# Altium schematic sheet I2C_AccGyro.SchDoc
size A
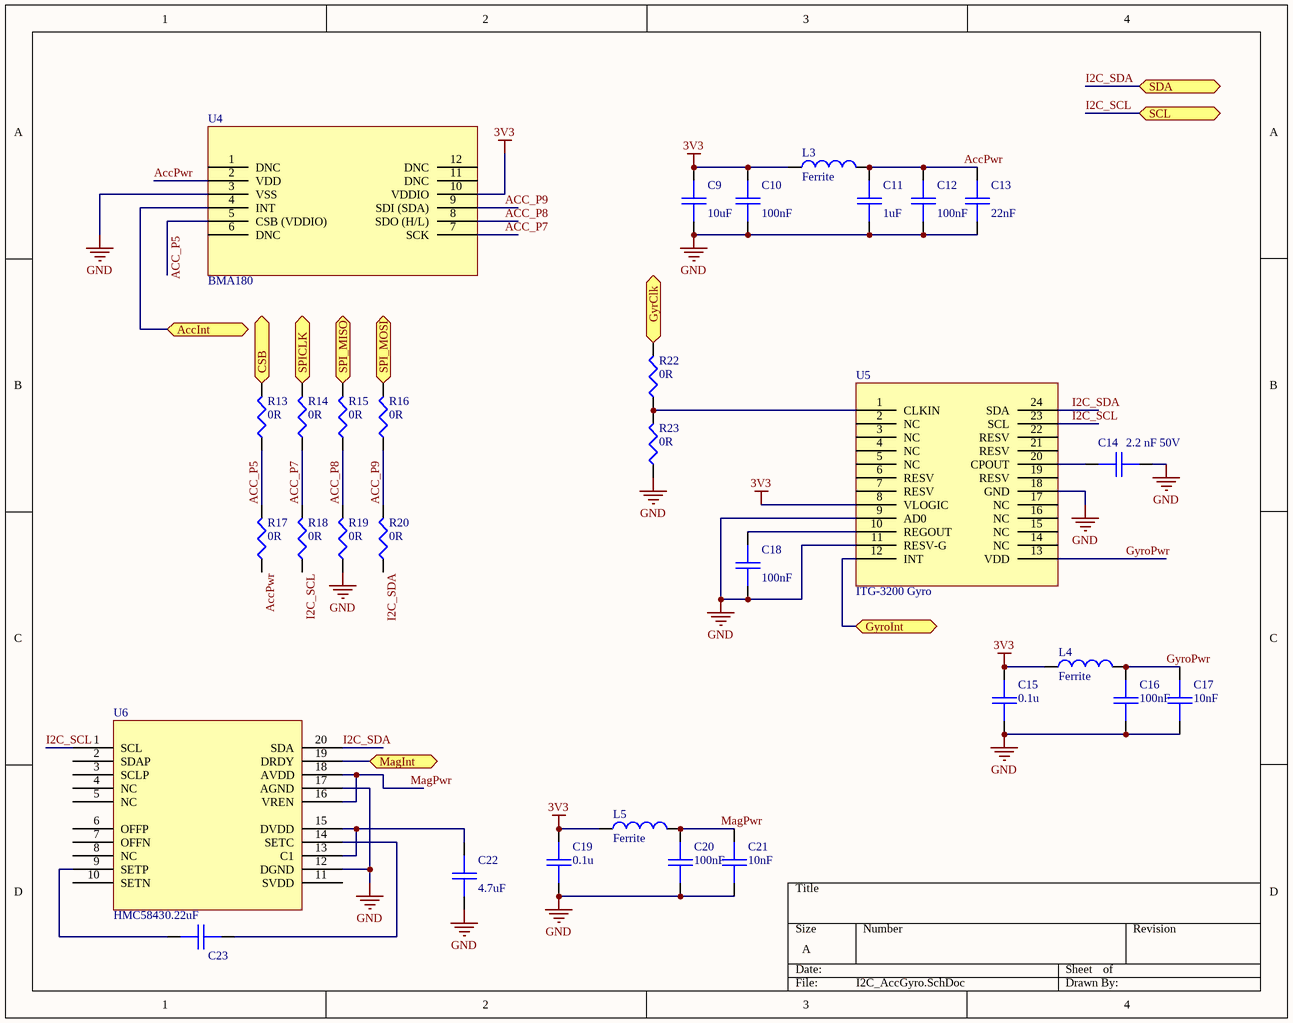
[diagram p0: I2C_AccGyro.SchDoc]

## Parts
C9  value 10uF  [0603]  (hidden comment: 10u)
C10  value 100nF  [0603]  (hidden comment: 0.1u)
C11  value 1uF  [0603]  (hidden comment: 1u)
C12  100nF  [0603]
C13  22nF  [0603]
C14  value 2.2 nF 50V  [0603]  (hidden comment: 2.2n 50V)
C15  0.1u  [0603]
C16  100nF  [0603]
C17  10nF  [0603]
C18  value 100nF  [0603]  (hidden comment: 100n)
C19  0.1u  [0603]
C20  100nF  [0603]
C21  10nF  [0603]
C22  value 4.7uF  [0603]  (hidden comment: 4.7u)
C23  value 0.22uF  [0603]  (hidden comment: 0.22u)
L3  Ferrite  [0603]
L4  Ferrite  [0603]
L5  Ferrite  [0603]
R13  0R  [0603]
R14  0R  [0603]
R15  0R  [0603]
R16  0R  [0603]
R17  0R  [0603]
R18  0R  [0603]
R19  0R  [0603]
R20  0R  [0603]
R22  0R  [0603]
R23  0R  [0603]
U4  BMA180  [LGA - BMA180]
U5  ITG-3200 Gyro  [ITG-3200 - QFN 24 Pin]
U6  HMC5843  [HMC5843 - LPCC 20 Pin]

## Ports
AccInt, CSB (in), GyrClk (in), GyroInt, MagInt, SCL, SDA, SPI_MISO, SPI_MOSI, SPICLK

## Nets
3V3: C9.1 C10.1 C15.1 C19.1 L3.1 L4.1 L5.1 U4.10(VDDIO) U5.8(VLOGIC)
GND: C9.2 C10.2 C11.2 C12.2 C13.2 C14.2 C15.2 C16.2 C17.2 C18.2 C19.2 C20.2 C21.2 C22.2 R19.1 R23.1 U4.3(VSS) U5.9(AD0) U5.11(RESV-G) U5.18(GND) U6.12(DGND) U6.17(AGND)
ACC_P5: R13.1 R17.2 U4.5(CSB_(VDDIO))
ACC_P7: R14.1 R18.2 U4.7(SCK)
ACC_P8: R15.1 R19.2 U4.8(SDO_(H/L))
ACC_P9: R16.1 R20.2 U4.9(SDI_(SDA))
AccInt: U4.4(INT) ; port AccInt
AccPwr: C11.1 C12.1 C13.1 L3.2 R17.1 U4.2(VDD)
CSB: R13.2 ; port CSB
GyrClk: R22.2 ; port GyrClk
GyroInt: U5.12(INT) ; port GyroInt
GyroPwr: C16.1 C17.1 L4.2 U5.13(VDD)
I2C_SCL: R18.1 U5.23(SCL) U6.1(SCL) ; port SCL
I2C_SDA: R20.1 U5.24(SDA) U6.20(SDA) ; port SDA
MagInt: U6.19(DRDY) ; port MagInt
MagPwr: C20.1 C21.1 L5.2 U6.16(VREN) U6.18(AVDD)
SPI_MISO: R15.2 ; port SPI_MISO
SPI_MOSI: R16.2 ; port SPI_MOSI
SPICLK: R14.2 ; port SPICLK
NetC14_1: C14.1 U5.20(CPOUT)
NetC18_1: C18.1 U5.10(REGOUT)
NetC22_1: C22.1 U6.13(C1) U6.15(DVDD)
NetC23_1: C23.1 U6.14(SETC)
NetC23_2: C23.2 U6.9(SETP)
NetR22_1: R22.1 R23.2 U5.1(CLKIN)

Not connected (* = marked no-connect by the designer): U4 1(DNC) 6(DNC) 11(DNC) 12(DNC); U5 2(NC) 3(NC) 4(NC) 5(NC) 6(RESV) 7(RESV) 14(NC) 15(NC) 16(NC) 17(NC) 19(RESV) 21(RESV) 22(RESV); U6 2(SDAP) 3(SCLP) 4(NC) 5(NC) 6(OFFP) 7(OFFN) 8(NC) 10(SETN) 11(SVDD)

## Library data of the parts
C9 C11 C13 C14 C22 C23 = CAP: Capacitor; Needed?: Yes - See Spreadsheet
  C13: Value: 22nF
  C14 C22 C23: Revision: July-2002: Re-released for DXP Platform.
C10 C12 C16-C18 C20 C21 = CAP: Capacitor; Needed?: NO - HW LAB
  C12 C16 C20: Value: 100nF
  C17 C21: Value: 10nF
  C18: Revision: July-2002: Re-released for DXP Platform.
C15 C19 = CAP: Capacitor; Value: 100nF; Needed?: NO - HW LAB
L3-L5 = INDUCTOR: Manufacturer: Generic Components; Needed?: Yes - See Spreadsheet; Published: 8-Jun-2000; Revision: July-2002: Re-released for DXP Platform.; Publisher: Altium Limited
R13-R20 R22 R23 = RES1: Resistor; Needed?: NO - HW LAB; Value: 0R
U4 = BMA180: Needed?: Special
U5 = ITG-3200: Needed?: Special
U6 = HMC5843: Needed?: Special